# Altium schematic sheet MdA_RS485.SchDoc: **
size A4; Author: **; CompanyName: Introducción al Diseño de Circuitos Impresos; Organization: UTN FRBA; Revision: **; SheetNumber: 2; SheetTotal: 4
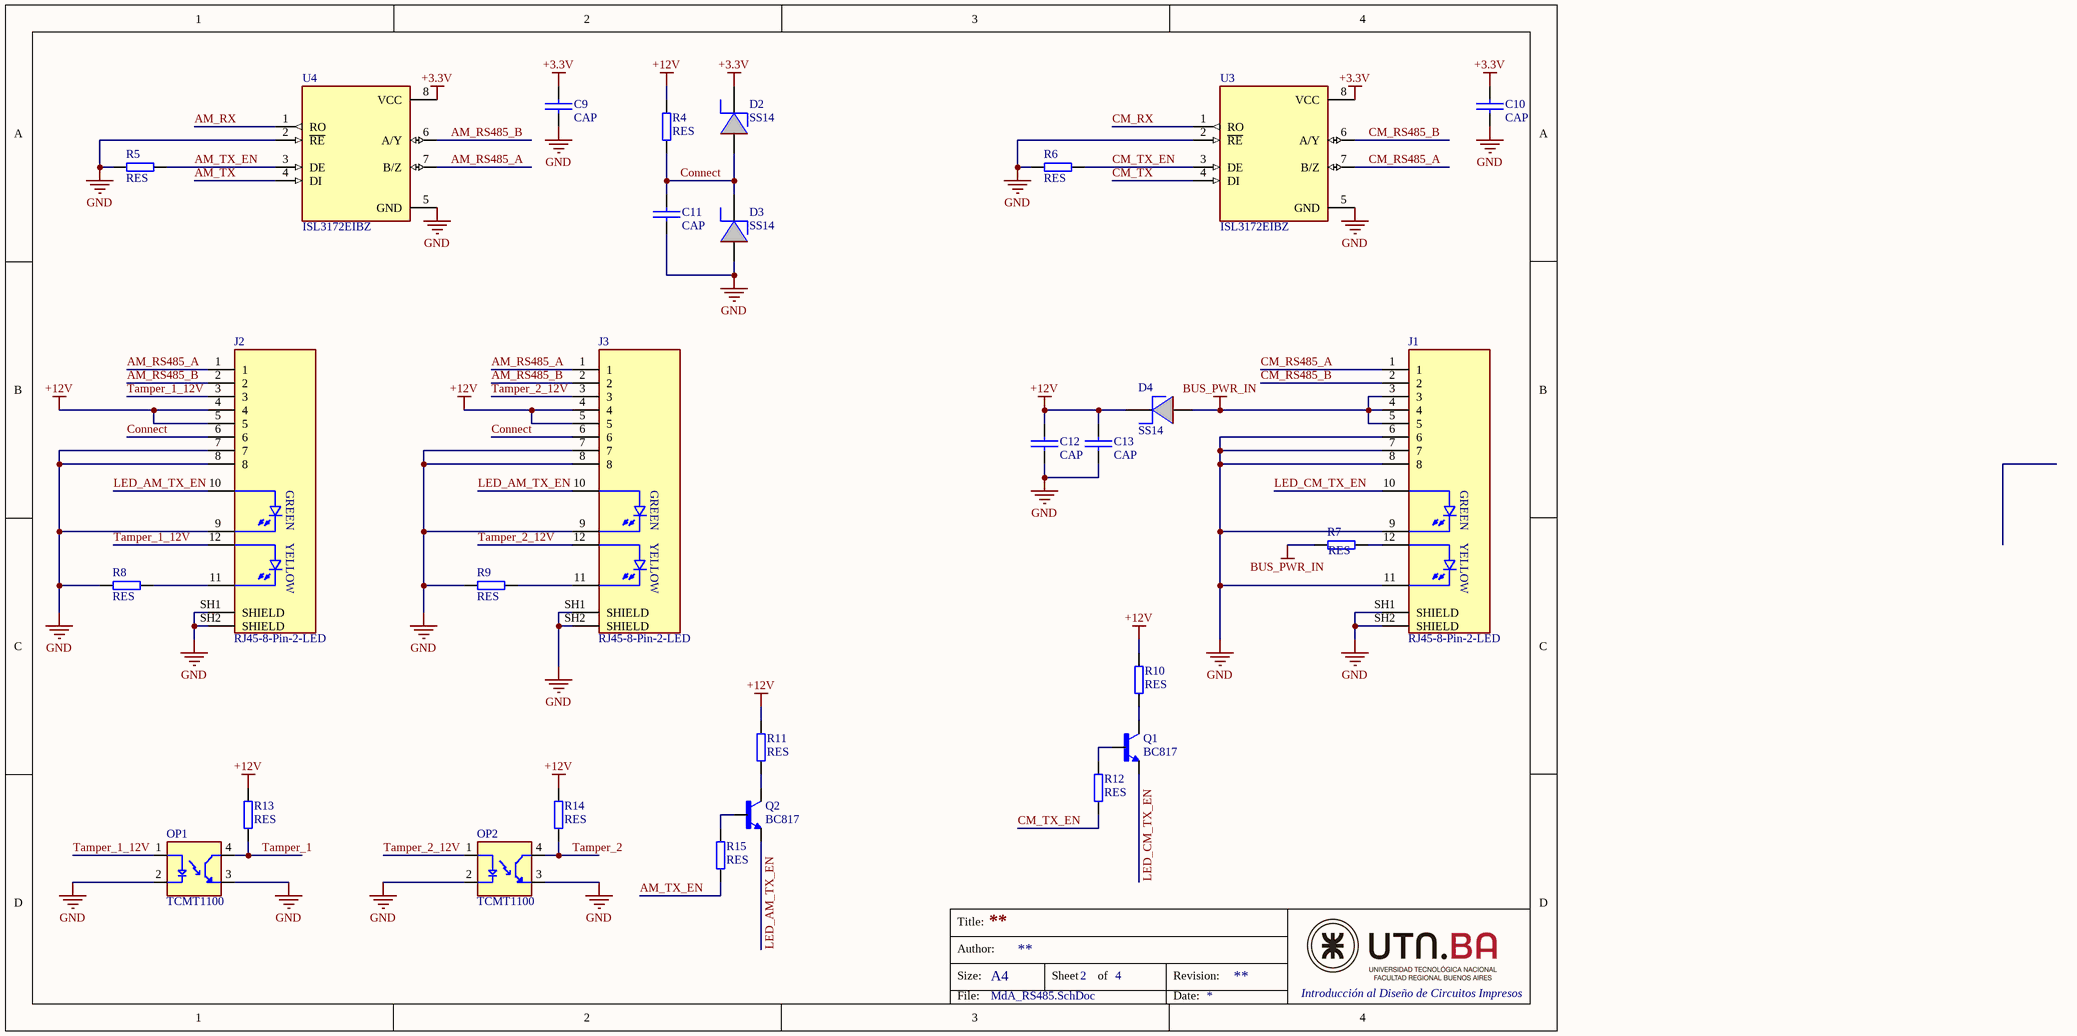
[diagram p0: MdA_RS485.SchDoc]

## Parts
C9  CAP  [C_0402]
C10  CAP  [C_0402]
C11  CAP  [C_0402]
C12  CAP  [C_0402]
C13  CAP  [C_0603]
D2  SS14  [D_SMA]
D3  SS14  [D_SMA]
D4  SS14  [D_SMA]
J1  RJ45-8-Pin-2-LED  [RJ45-8-Pin-2-Led]
J2  RJ45-8-Pin-2-LED  [RJ45-8-Pin-2-Led]
J3  RJ45-8-Pin-2-LED  [RJ45-8-Pin-2-Led]
OP1  TCMT1100  [SSOP4]
OP2  TCMT1100  [SSOP4]
Q1  BC817  [SOT-23-3]
Q2  BC817  [SOT-23-3]
R4  RES  [R_0402]
R5  RES  [R_0402]
R6  RES  [R_0402]
R7  RES  [R_0402]
R8  RES  [R_0402]
R9  RES  [R_0402]
R10  RES  [R_0402]
R11  RES  [R_0402]
R12  RES  [R_0402]
R13  RES  [R_0402]
R14  RES  [R_0402]
R15  RES  [R_0402]
U3  ISL3172EIBZ  [SOIC-8]
U4  ISL3172EIBZ  [SOIC-8]

## Nets
+3.3V: C9.1 C10.1 D2.2(K) U3.8(VCC) U4.8(VCC)
+12V: C12.1 C13.1 D4.2(K) J2.4 J2.5 J3.4 J3.5 R4.1 R10.1 R11.1 R13.1 R14.1
BUS_PWR_IN: D4.1(A) J1.3 J1.4 J1.5 R7.2
GND: C9.2 C10.2 C11.2 C12.2 C13.2 D3.1(A) J1.6 J1.7 J1.8 J1.9 J1.11 J1.SH1(SHIELD) J1.SH2(SHIELD) J2.7 J2.8 J2.9 J2.SH1(SHIELD) J2.SH2(SHIELD) J3.7 J3.8 J3.9 J3.SH1(SHIELD) J3.SH2(SHIELD) OP1.2(C) OP1.3(ET) OP2.2(C) OP2.3(ET) R5.2 R6.2 R8.2 R9.2 U3.2(~{RE}) U3.5(GND) U4.2(~{RE}) U4.5(GND)
AM_RS485_A: J2.1 J3.1 U4.7(B/Z)
AM_RS485_B: J2.2 J3.2 U4.6(A/Y)
AM_RX: U4.1(RO)
AM_TX: U4.4(DI)
AM_TX_EN: R5.1 R15.2 U4.3(DE)
CM_RS485_A: J1.1 U3.7(B/Z)
CM_RS485_B: J1.2 U3.6(A/Y)
CM_RX: U3.1(RO)
CM_TX: U3.4(DI)
CM_TX_EN: R6.1 R12.2 U3.3(DE)
Connect: C11.1 D2.1(A) D3.2(K) J2.6 J3.6 R4.2
LED_AM_TX_EN: J2.10 J3.10 Q2.2(E)
LED_CM_TX_EN: J1.10 Q1.2(E)
Tamper_1: OP1.4(CT) R13.2
Tamper_1_12V: J2.3 J2.12 OP1.1(A)
Tamper_2: OP2.4(CT) R14.2
Tamper_2_12V: J3.3 J3.12 OP2.1(A)
NetJ1_12: J1.12 R7.1
NetJ2_11: J2.11 R8.1
NetJ3_11: J3.11 R9.1
NetQ1_1: Q1.1(B) R12.1
NetQ1_3: Q1.3(C) R10.2
NetQ2_1: Q2.1(B) R15.1
NetQ2_3: Q2.3(C) R11.2

## Notes on the sheet
- Title:
- Size:
- Author:
- A4
- Sheet
- of
- Revision:
- File:
- Date:
- (in symbol RJ45-8-Pin-2-LED) GREEN; YELLOW

## Library data of the parts
D2-D4 = DIODE_SH
U3 U4 = ISL3172EIBZ: Transceiver Half RS422, RS485 8-SOIC